# EAGLE schematic Template (EAGLE 9.6.2)
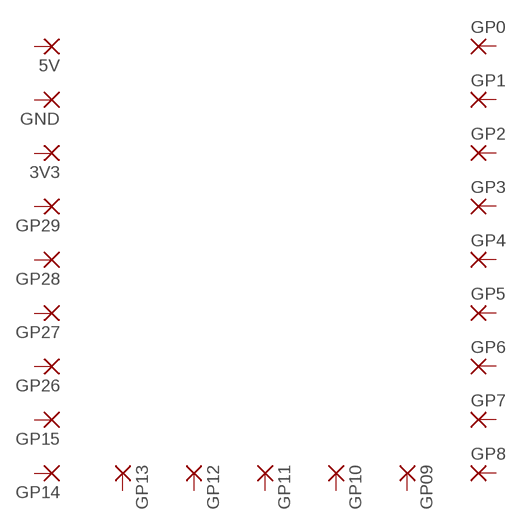
[diagram p0: schematic, sheet 1]

## Parts
3V3  1,6/0,9  [1,6/0,9]
5V  1,6/0,9  [1,6/0,9]
GND  1,6/0,9  [1,6/0,9]
GP0  1,6/0,9  [1,6/0,9]
GP1  1,6/0,9  [1,6/0,9]
GP2  1,6/0,9  [1,6/0,9]
GP3  1,6/0,9  [1,6/0,9]
GP4  1,6/0,9  [1,6/0,9]
GP5  1,6/0,9  [1,6/0,9]
GP6  1,6/0,9  [1,6/0,9]
GP7  1,6/0,9  [1,6/0,9]
GP8  1,6/0,9  [1,6/0,9]
GP09  1,6/0,9  [1,6/0,9]
GP10  1,6/0,9  [1,6/0,9]
GP11  1,6/0,9  [1,6/0,9]
GP12  1,6/0,9  [1,6/0,9]
GP13  1,6/0,9  [1,6/0,9]
GP14  1,6/0,9  [1,6/0,9]
GP15  1,6/0,9  [1,6/0,9]
GP26  1,6/0,9  [1,6/0,9]
GP27  1,6/0,9  [1,6/0,9]
GP28  1,6/0,9  [1,6/0,9]
GP29  1,6/0,9  [1,6/0,9]
Unconnected: 3V3.1(P) 5V.1(P) GND.1(P) GP0.1(P) GP1.1(P) GP2.1(P) GP3.1(P) GP4.1(P) GP5.1(P) GP6.1(P) GP7.1(P) GP8.1(P) GP09.1(P) GP10.1(P) GP11.1(P) GP12.1(P) GP13.1(P) GP14.1(P) GP15.1(P) GP26.1(P) GP27.1(P) GP28.1(P) GP29.1(P)

## Library data of the parts
3V3 5V GND GP0 GP1-GP8 GP09 GP10-GP15 GP26-GP29 = Codeworks-Pads:1,6/0,9: THROUGH-HOLE PAD